# EAGLE design infinite_progress (EAGLE 9.6.0)
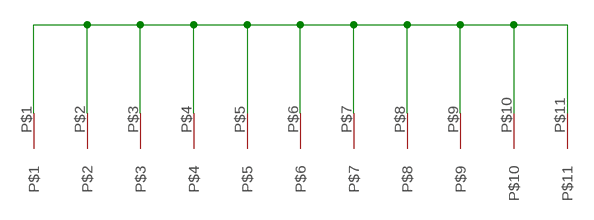
[diagram p0: schematic, sheet 1]

## Parts
U$1  ADVCHIP  [ADCHIP]

## Nets
N$1: U$1.P$1 U$1.P$2 U$1.P$3 U$1.P$4 U$1.P$5 U$1.P$6 U$1.P$7 U$1.P$8 U$1.P$9 U$1.P$10 U$1.P$11

## Library data of the parts
U$1 = advpins:ADVCHIP

## Board
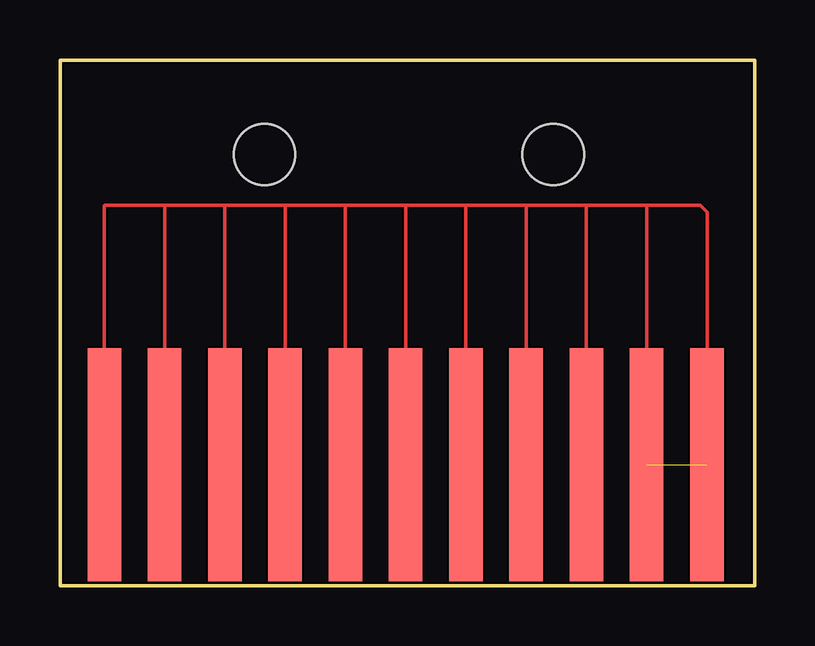
[diagram p1: board, top side]

Size 28.95 x 21.9 mm. Coordinates in mm from the lower left corner, seen from the top.
Outline: 0.05,0 28.95,0 28.95,21.9 0.05,21.9
Outline: 0,0 0,21.9
Copper layers (1*16): Top 0.035mm / dielectric 1.5mm / Bottom 0.035mm
Design rules "default *": minimum track width 6mil, minimum drill 0.35mm, track to track 0.25mil, track to pad 6mil, pad to pad 6mil, via to via 6mil, smd to smd 6mil, copper to edge 0.002540625mm, drill to drill 1mil, minimum pad ring 10mil, minimum via ring 8mil, stop-mask expansion 4mil, vias tented up to drill 0mil, thermal gap 10mil
Holes 2.56 mm at 8.52,17.96 20.55,17.96

### Footprints (pad centres in the part's own frame; a part is rotated, then mirrored left to right if it is on the bottom)
ADCHIP = smd 1.4 x 9.7: P$1 -27.61,5.02; P$2 -25.1,5.02; P$3 -22.59,5.02; P$4 -20.08,5.02; P$5 -17.57,5.02; P$6 -15.06,5.02; P$7 -12.55,5.02; P$8 -10.04,5.02; P$9 -7.53,5.02; P$10 -5.02,5.02; P$11 -2.51,5.02

### Placement (x,y rotation side)
U$1  29.46,0.02 0 top

### Tracks (layer width: path | path; a pad name or v marks a point on that pad's centre or on a via)
N$1  (1 unrouted)
  Top 0.152: U$1.P$1 1.85,15.83 1.87,15.85 4.35,15.85 | 4.35,15.85 6.86,15.85 | 6.86,15.85 9.38,15.85 | 9.38,15.85 11.93,15.85 | 11.93,15.85 14.39,15.85 | 14.39,15.85 16.9,15.85 | 16.9,15.85 19.43,15.85 | 19.43,15.85 21.95,15.85 | 21.95,15.85 24.43,15.85 | 24.43,15.85 26.67,15.85 26.97,15.55 26.97,9.73 | U$1.P$2 4.36,15.85 4.35,15.85 | U$1.P$3 6.87,15.84 6.86,15.85 | U$1.P$4 9.38,15.85 | U$1.P$5 11.89,15.81 11.93,15.85 | U$1.P$6 14.4,15.85 14.39,15.85 | U$1.P$7 16.91,15.84 16.9,15.85 | U$1.P$8 19.42,15.84 19.43,15.85 | U$1.P$9 21.93,15.83 21.95,15.85 | U$1.P$10 24.44,15.84 24.43,15.85